# Altium schematic sheet USB_OTG_FS.SchDoc
size A4; Revision: C.2(PCB.SCH)
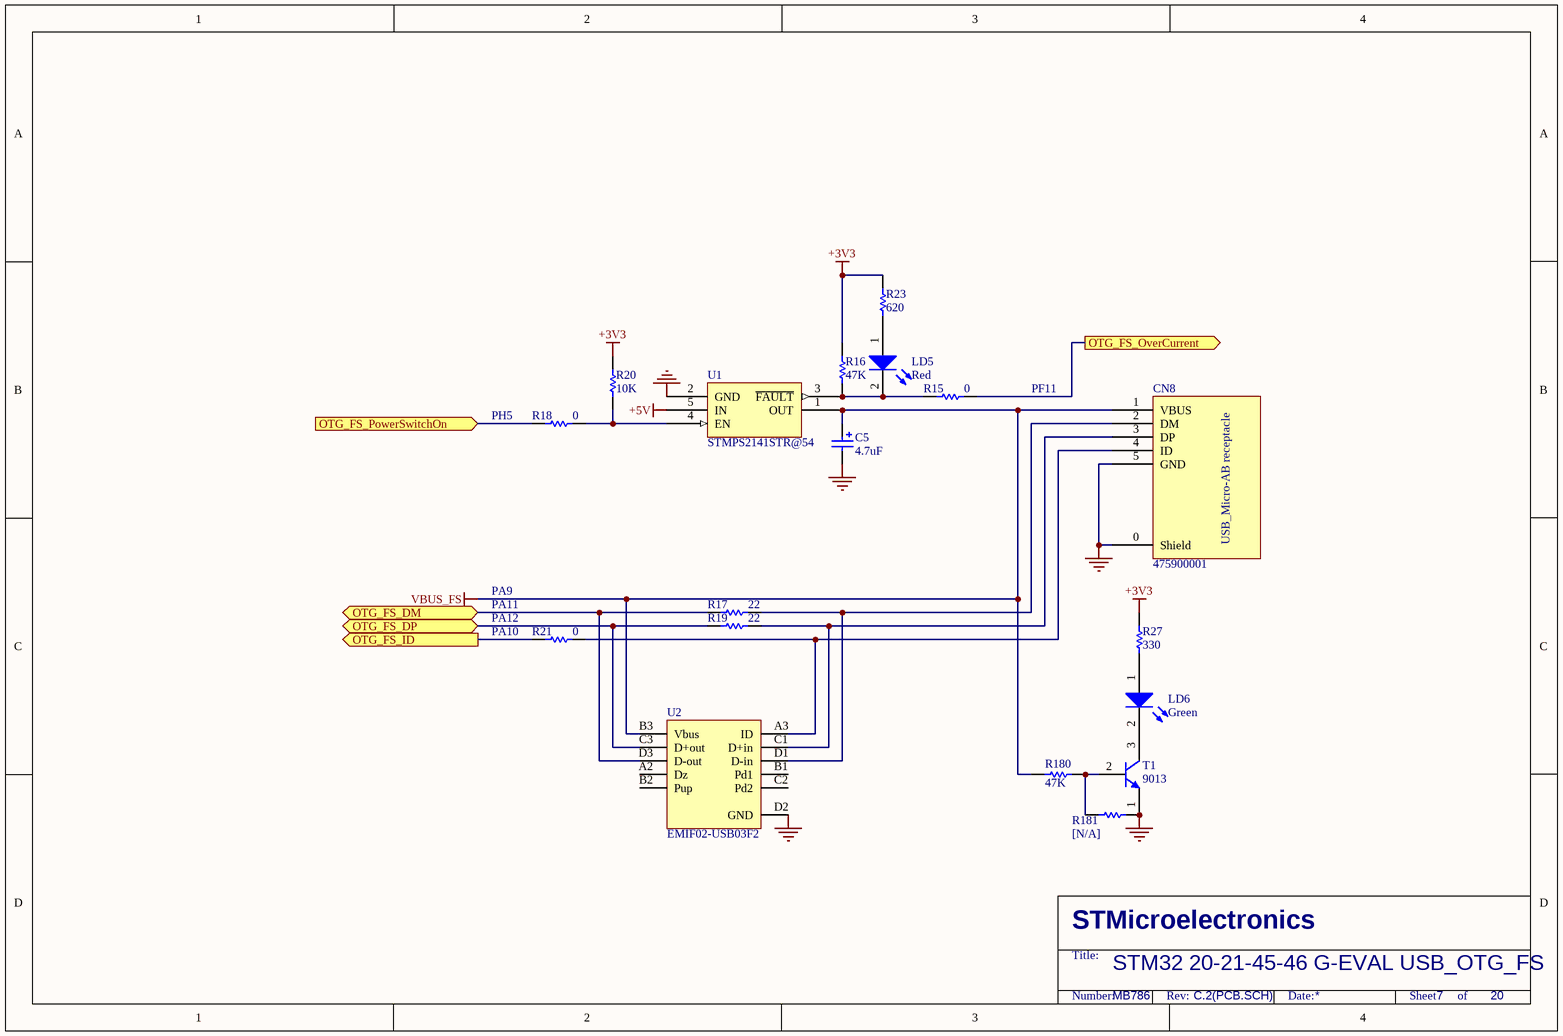
[diagram p0: USB_OTG_FS.SchDoc]

## Parts
C5  4.7uF  [TAN-A]
CN8  475900001  [USB-MICRO-AB]
LD5  Red  [0603D]
LD6  Green  [0603D]
R15  0  [0603R]
R16  47K  [0402R]
R17  22  [0603R]
R18  0  [0603R]
R19  22  [0603R]
R20  10K  [0402R]
R21  0  [0603R]
R23  620  [0603R]
R27  330  [0603R]
R180  47K  [0402R]
R181  [N/A]  [0603R]
T1  9013  [SOT-23]
U1  STMPS2141STR@54  [SOT-23-5L]
U2  EMIF02-USB03F2  [FlipChip(11)]

## Ports
OTG_FS_DM (bidir), OTG_FS_DP (bidir), OTG_FS_ID (out), OTG_FS_OverCurrent (out), OTG_FS_PowerSwitchOn (in)

## Nets
+3V3: R16.1 R20.1 R23.2 R27.2
+5V: U1.5(IN)
GND: C5.2 CN8.0(Shield) CN8.5(GND) R181.1 T1.1(E) U1.2(GND) U2.D2(GND)
VBUS_FS: C5.1 CN8.1(VBUS) R180.2 U1.1(OUT) U2.B3(Vbus)
OTG_FS_DM: R17.2 U2.D3(D-out) ; port OTG_FS_DM
OTG_FS_DP: R19.2 U2.C3(D+out) ; port OTG_FS_DP
OTG_FS_ID: R21.2 ; port OTG_FS_ID
OTG_FS_OverCurrent: R15.1 ; port OTG_FS_OverCurrent
OTG_FS_PowerSwitchOn: R18.2 ; port OTG_FS_PowerSwitchOn
NetCN8_2: CN8.2(DM) R17.1 U2.D1(D-in)
NetCN8_3: CN8.3(DP) R19.1 U2.C1(D+in)
NetCN8_4: CN8.4(ID) R21.1 U2.A3(ID)
NetLD5_1: LD5.1(A) R23.1
NetLD5_2: LD5.2(K) R15.2 R16.2 U1.3(~{FAULT})
NetLD6_1: LD6.1(A) R27.1
NetLD6_2: LD6.2(K) T1.3(C)
NetR18_1: R18.1 R20.2 U1.4(EN)
NetR180_1: R180.1 R181.2 T1.2(B)

Not connected (* = marked no-connect by the designer): U2 A2(Dz) B1(Pd1) B2(Pup) C2(Pd2)

## Notes on the sheet
- (near R18) PH5
- PF11
- PA9
- (near R21) PA10
- (near R21) PA11
- (near R21) PA12
- STM32 20-21-45-46 G-EVAL USB_OTG_FS
- MB786
- 7
- 20
- STMicroelectronics
- Title:
- Number:
- Rev:
- Date:
- Sheet       of
- (in symbol 475900001) USB_Micro-AB receptacle

## Library data of the parts
C5 = Cap Pol1: Polarized Capacitor (Radial); Value: 47uF; Published: 8-Jun-2000; Revision: July-2002: Re-released for DXP Platform.; Publisher: Altium Limited
LD5 LD6 = LED2: Typical RED, GREEN, YELLOW, AMBER GaAs LED; Published: 8-Jun-2000; Revision: July-2002: Re-released for DXP Platform.; Publisher: Altium Limited
R15 R17-R19 R21 R23 = Res1: Resistor; Value: 1K; Published: 8-Jun-2000; Revision: July-2002: Re-released for DXP Platform.; Publisher: Altium Limited
R16 R20 R27 R180 R181 = res1: Resistor; Value: 1K; Published: 8-Jun-2000; Revision: July-2002: Re-released for DXP Platform.; Publisher: Altium Limited
T1 = NPN: NPN Bipolar Transistor; Code - JEDEC: TO-226-AA; Published: 8-Jun-2000; Revision: July-2002: Re-released for DXP Platform.; Publisher: Altium Limited
U1 = STMPS2141STR